# Altium schematic sheet IOT_GRN_MAIN V1.0 A.SchDoc
size A4; Email: eliofagundez07@gmail.com; DrawnBy: ELIO F.; Engineer: ELIO F.; Revision: A; SheetNumber: 1; SheetTotal: 3; Sheet Title: Cover Page
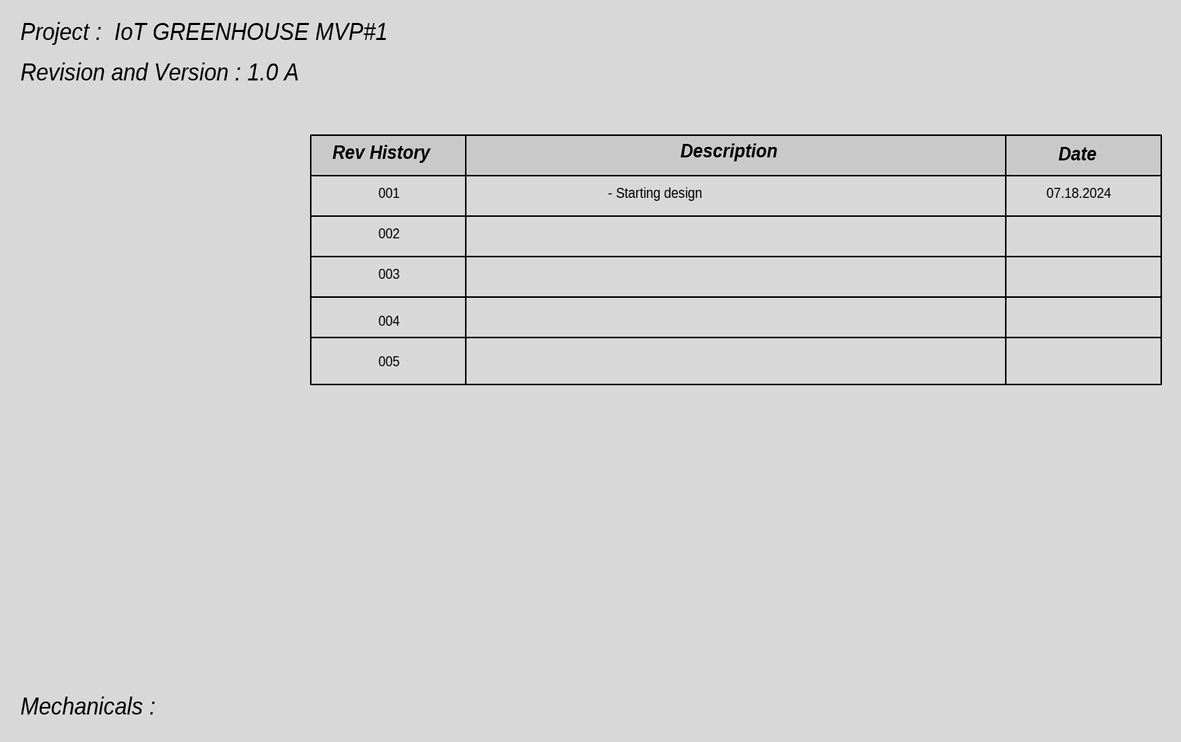
[diagram p0: IOT_GRN_MAIN V1.0 A.SchDoc]

## Notes on the sheet
- Project :  IoT GREENHOUSE MVP#1
- Revision and Version : 1.0 A
- Rev History
- 001
- - Starting design
- Description
- 07.18.2024
- Date
- 002
- 003
- 004
- 005
- Mechanicals :
- PCB Des :
- Approv By :
- Project Title :
- Sheet Title :
- Date :
- PCB Version :
- Size :
- A4
- Page :
- PCB Revision :